# Altium schematic sheet Sheet4.SchDoc: Контроллер нетривиального станка с ЧПУ
size 420 x 297 mm; Author: Барков; CompanyName: BarCockSemenConductor; DrawnBy: Барков; Engineer: Барков; Organization: BarCockSemenConductor; DocumentNumber: хххххххх; SheetNumber: 4; SheetTotal: 5; DocumentName: Sheet1.SCHDOC
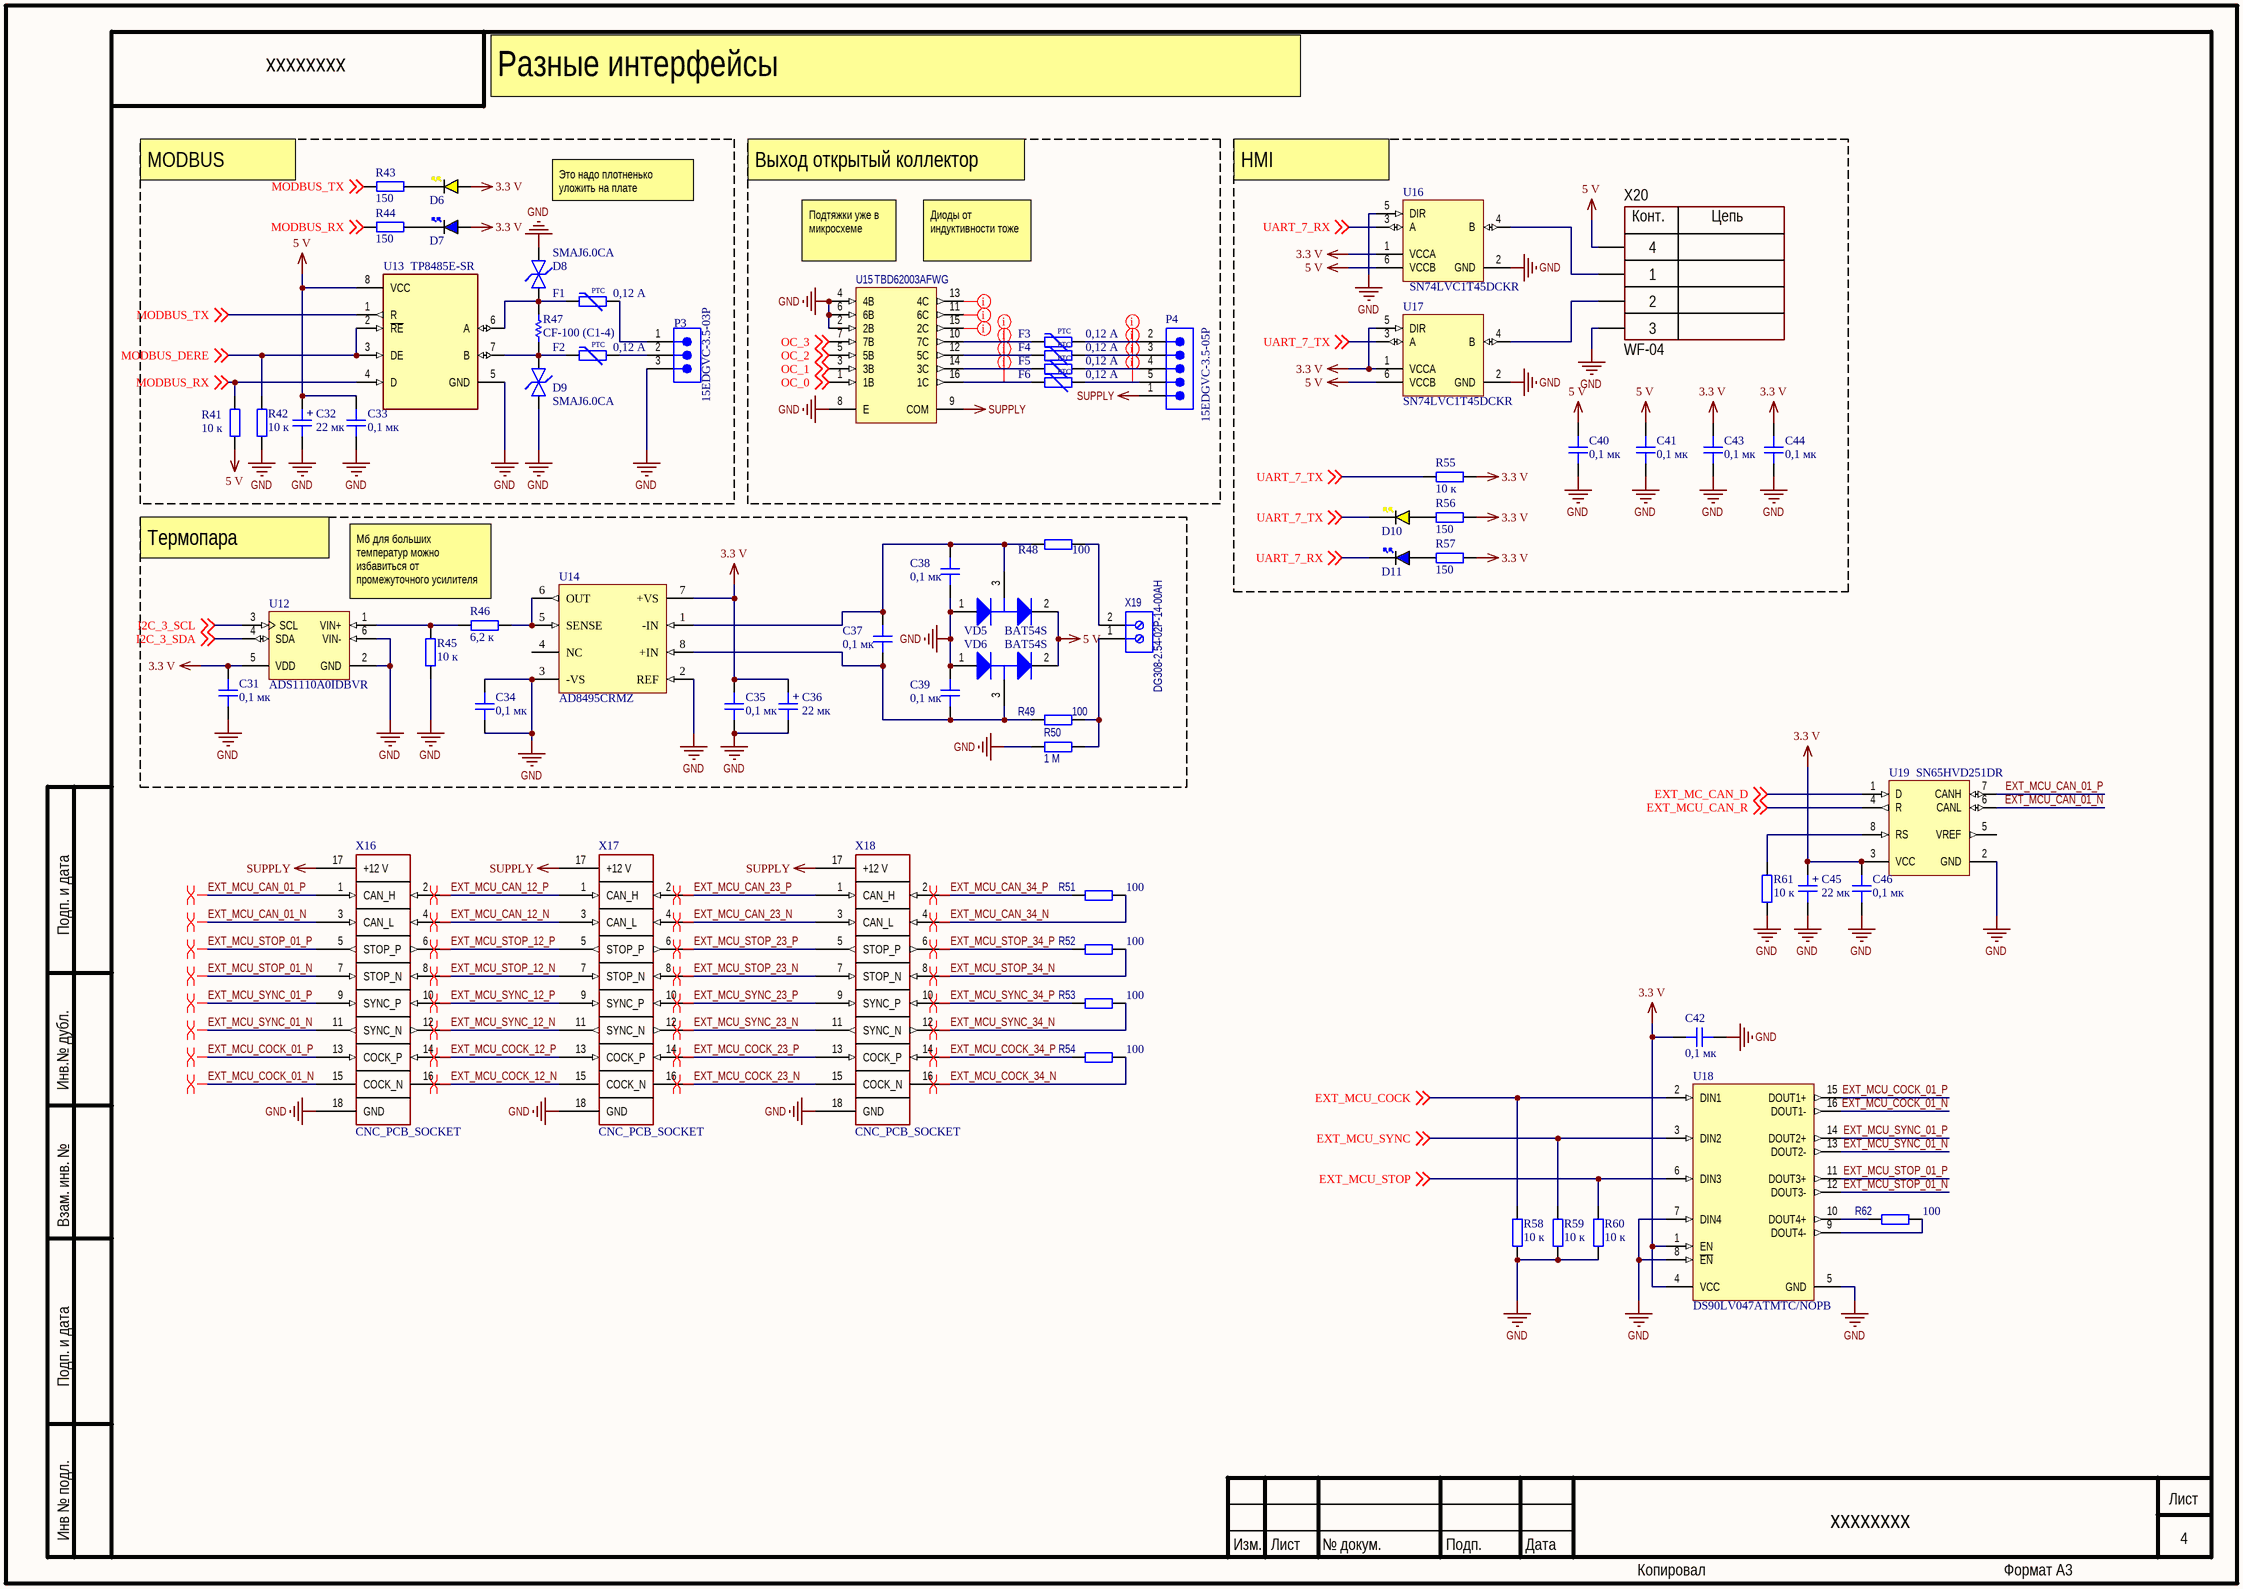
[diagram p0: Sheet4.SchDoc]

## Parts
C31  0,1 мк  [CAP_0603]
C32  22 мк  [TANTAL_B]
C33  0,1 мк  [CAP_0603]
C34  0,1 мк  [CAP_0603]
C35  0,1 мк  [CAP_0603]
C36  22 мк  [TANTAL_B]
C37  0,1 мк  [CAP_0603]
C38  0,1 мк  [CAP_0603]
C39  0,1 мк  [CAP_0603]
C40  0,1 мк  [CAP_0603]
C41  0,1 мк  [CAP_0603]
C42  0,1 мк  [CAP_0603]
C43  0,1 мк  [CAP_0603]
C44  0,1 мк  [CAP_0603]
C45  22 мк  [TANTAL_B]
C46  0,1 мк  [CAP_0603]
D6  YELLOW  [LED_0603_YELLOW]  (value not drawn)
D7  BLUE  [LED_0603_BLUE]  (value not drawn)
D8  SMAJ6.0CA  [SMA]
D9  SMAJ6.0CA  [SMA]
D10  YELLOW  [LED_0603_YELLOW]  (value not drawn)
D11  BLUE  [LED_0603_BLUE]  (value not drawn)
F1  0,12 А  [FUSE_1206]
F2  0,12 А  [FUSE_1206]
F3  0,12 А  [FUSE_1206]
F4  0,12 А  [FUSE_1206]
F5  0,12 А  [FUSE_1206]
F6  0,12 А  [FUSE_1206]
P3  15EDGVC-3.5-03P  [691321100003]
P4  15EDGVC-3.5-05P  [691321100005]
R41  10 к  [RES_0603]
R42  10 к  [RES_0603]
R43  150  [RES_0603]
R44  150  [RES_0603]
R45  10 к  [RES_0603]
R46  6,2 к  [RES_0603]
R47  CF-100 (С1-4)  [OMTE-RES7X2.5-2]
R48  100  [RES_0603]
R49  100  [RES_0603]
R50  1 М  [RES_0603]
R51  100  [RES_0603]
R52  100  [RES_0603]
R53  100  [RES_0603]
R54  100  [RES_0603]
R55  10 к  [RES_0603]
R56  150  [RES_0603]
R57  150  [RES_0603]
R58  10 к  [RES_0603]
R59  10 к  [RES_0603]
R60  10 к  [RES_0603]
R61  10 к  [RES_0603]
R62  100  [RES_0603]
U12  ADS1110A0IDBVR  [TI-DBV6_M]
U13  TP8485E-SR  [FP-D0008A-MFG]
U14  AD8495CRMZ  [FP-RM-8-IPC_A]
U15  TBD62003AFWG  [D0016A_M]
U16  SN74LVC1T45DCKR  [DCK0006A_L]
U17  SN74LVC1T45DCKR  [DCK0006A_L]
U18  DS90LV047ATMTC/NOPB  [MTC16_M]
U19  SN65HVD251DR  [D0008A_N]
VD5  BAT54S  [ONSC-SOT-323-3-419-04_V]
VD6  BAT54S  [ONSC-SOT-323-3-419-04_V]
X16  CNC_PCB_SOCKET  [CNC_PCB_SOCKET]  (no BOM)
X17  CNC_PCB_SOCKET  [CNC_PCB_SOCKET]  (no BOM)
X18  CNC_PCB_SOCKET  [CNC_PCB_SOCKET]  (no BOM)
X19  DG308-2.54-02P-14-00AH  [PHOE-1725656-2]
X20  WF-04  [CON: WF-04]

## Nets
3.3 V: C31.1 C35.1 C36.1 C42.1 C43.1 C44.1 C45.1 C46.1 D6.A D7.A R55.1 R56.2 R57.2 U12.5(VDD) U14.7(+VS) U16.1(VCCA) U17.1(VCCA) U17.5(DIR) U18.1(EN) U18.4(VCC) U19.3(VCC)
5 V: C32.1 C33.1 C40.1 C41.1 R41.2 U13.8(VCC) U16.6(VCCB) U17.6(VCCB) VD5.2(K) VD6.2(K) X20.4
GND: C31.2 C32.2 C33.2 C34.1 C34.2 C35.2 C36.2 C38.2 C39.1 C40.2 C41.2 C42.2 C43.2 C44.2 C45.2 C46.2 D8.K D9.A P3.3 R42.1 R45.1 R50.2 R58.2 R59.2 R60.1 R61.1 U12.2(GND) U12.6(VIN-) U13.5(GND) U14.2(REF) U14.3(-VS) U15.2(2B) U15.4(4B) U15.6(6B) U15.8(E) U16.2(GND) U16.5(DIR) U17.2(GND) U18.5(GND) U18.7(DIN4) U18.8(~{EN}) U19.2(GND) VD5.1(A) VD6.1(A) X16.18(GND) X17.18(GND) X18.18(GND) X20.3
SUPPLY: P4.1 U15.9(COM) X16.17(+12_V) X17.17(+12_V) X18.17(+12_V)
EXT_MC_CAN_D: U19.1(D) ; off-sheet EXT_MC_CAN_D
EXT_MCU_CAN_01_N: U19.6(CANL) X16.3(CAN_L)
EXT_MCU_CAN_01_P: U19.7(CANH) X16.1(CAN_H)
EXT_MCU_CAN_12_N: X16.4(CAN_L) X17.3(CAN_L)
EXT_MCU_CAN_12_P: X16.2(CAN_H) X17.1(CAN_H)
EXT_MCU_CAN_23_N: X17.4(CAN_L) X18.3(CAN_L)
EXT_MCU_CAN_23_P: X17.2(CAN_H) X18.1(CAN_H)
EXT_MCU_CAN_34_N: R51.1 X18.4(CAN_L)
EXT_MCU_CAN_34_P: R51.2 X18.2(CAN_H)
EXT_MCU_CAN_R: U19.4(R) ; off-sheet EXT_MCU_CAN_R
EXT_MCU_COCK: R58.1 U18.2(DIN1) ; off-sheet EXT_MCU_COCK
EXT_MCU_COCK_01_N: U18.16(DOUT1-) X16.15(COCK_N)
EXT_MCU_COCK_01_P: U18.15(DOUT1+) X16.13(COCK_P)
EXT_MCU_COCK_12_N: X16.16(COCK_N) X17.15(COCK_N)
EXT_MCU_COCK_12_P: X16.14(COCK_P) X17.13(COCK_P)
EXT_MCU_COCK_23_N: X17.16(COCK_N) X18.15(COCK_N)
EXT_MCU_COCK_23_P: X17.14(COCK_P) X18.13(COCK_P)
EXT_MCU_COCK_34_N: R54.1 X18.16(COCK_N)
EXT_MCU_COCK_34_P: R54.2 X18.14(COCK_P)
EXT_MCU_STOP: R60.2 U18.6(DIN3) ; off-sheet EXT_MCU_STOP
EXT_MCU_STOP_01_N: U18.12(DOUT3-) X16.7(STOP_N)
EXT_MCU_STOP_01_P: U18.11(DOUT3+) X16.5(STOP_P)
EXT_MCU_STOP_12_N: X16.8(STOP_N) X17.7(STOP_N)
EXT_MCU_STOP_12_P: X16.6(STOP_P) X17.5(STOP_P)
EXT_MCU_STOP_23_N: X17.8(STOP_N) X18.7(STOP_N)
EXT_MCU_STOP_23_P: X17.6(STOP_P) X18.5(STOP_P)
EXT_MCU_STOP_34_N: R52.1 X18.8(STOP_N)
EXT_MCU_STOP_34_P: R52.2 X18.6(STOP_P)
EXT_MCU_SYNC: R59.1 U18.3(DIN2) ; off-sheet EXT_MCU_SYNC
EXT_MCU_SYNC_01_N: U18.13(DOUT2-) X16.11(SYNC_N)
EXT_MCU_SYNC_01_P: U18.14(DOUT2+) X16.9(SYNC_P)
EXT_MCU_SYNC_12_N: X16.12(SYNC_N) X17.11(SYNC_N)
EXT_MCU_SYNC_12_P: X16.10(SYNC_P) X17.9(SYNC_P)
EXT_MCU_SYNC_23_N: X17.12(SYNC_N) X18.11(SYNC_N)
EXT_MCU_SYNC_23_P: X17.10(SYNC_P) X18.9(SYNC_P)
EXT_MCU_SYNC_34_N: R53.1 X18.12(SYNC_N)
EXT_MCU_SYNC_34_P: R53.2 X18.10(SYNC_P)
I2C_3_SCL: U12.3(SCL) ; off-sheet I2C_3_SCL
I2C_3_SDA: U12.4(SDA) ; off-sheet I2C_3_SDA
MODBUS_DERE: R42.2 U13.2(~{RE}) U13.3(DE) ; off-sheet MODBUS_DERE
MODBUS_RX: R41.1 R44.1 U13.4(D) ; off-sheet MODBUS_RX
MODBUS_TX: R43.1 U13.1(R) ; off-sheet MODBUS_TX
OС_0: U15.1(1B) ; off-sheet OС_0
OС_1: U15.3(3B) ; off-sheet OС_1
OС_2: U15.5(5B) ; off-sheet OС_2
OС_3: U15.7(7B) ; off-sheet OС_3
UART_7_RX: D11.K U16.3(A) ; off-sheet UART_7_RX
UART_7_TX: D10.K R55.2 U17.3(A) ; off-sheet UART_7_TX
NetC37_1: C37.1 C38.1 R48.1 U14.1(-IN) VD5.3(K/A)
NetC37_2: C37.2 C39.2 R49.1 U14.8(+IN) VD6.3(K/A)
NetD6_K: D6.K R43.2
NetD7_K: D7.K R44.2
NetD8_A: D8.A F1.2 R47.1 U13.6(A)
NetD9_K: D9.K F2.2 R47.2 U13.7(B)
NetD10_A: D10.A R56.1
NetD11_A: D11.A R57.1
NetF1_1: F1.1 P3.1
NetF2_1: F2.1 P3.2
NetF3_1: F3.1 P4.2
NetF3_2: F3.2 U15.10(7C)
NetF4_1: F4.1 P4.3
NetF4_2: F4.2 U15.12(5C)
NetF5_1: F5.1 P4.4
NetF5_2: F5.2 U15.14(3C)
NetF6_1: F6.1 P4.5
NetF6_2: F6.2 U15.16(1C)
NetR45_2: R45.2 R46.2 U12.1(VIN+)
NetR46_1: R46.1 U14.5(SENSE) U14.6(OUT)
NetR48_2: R48.2 X19.2
NetR49_2: R49.2 R50.1 X19.1
NetR61_2: R61.2 U19.8(RS)
NetR62_1: R62.1 U18.9(DOUT4-)
NetR62_2: R62.2 U18.10(DOUT4+)
NetU16_4: U16.4(B) X20.1
NetU17_4: U17.4(B) X20.2

Not connected (* = marked no-connect by the designer): U14 4(NC); U15 11(6C) 13(4C) 15(2C); U19 5(VREF)

## Layout directives
differential pair: EXT_MCU_CAN_01_N, EXT_MCU_CAN_01_P, EXT_MCU_CAN_12_N, EXT_MCU_CAN_12_P, EXT_MCU_CAN_23_N, EXT_MCU_CAN_23_P, EXT_MCU_CAN_34_N, EXT_MCU_CAN_34_P, EXT_MCU_COCK_01_N, EXT_MCU_COCK_01_P, EXT_MCU_COCK_12_N, EXT_MCU_COCK_12_P, EXT_MCU_COCK_23_N, EXT_MCU_COCK_23_P, EXT_MCU_COCK_34_N, EXT_MCU_COCK_34_P, EXT_MCU_STOP_01_N, EXT_MCU_STOP_01_P, EXT_MCU_STOP_12_N, EXT_MCU_STOP_12_P, EXT_MCU_STOP_23_N, EXT_MCU_STOP_23_P, EXT_MCU_STOP_34_N, EXT_MCU_STOP_34_P, EXT_MCU_SYNC_01_N, EXT_MCU_SYNC_01_P, EXT_MCU_SYNC_12_N, EXT_MCU_SYNC_12_P, EXT_MCU_SYNC_23_N, EXT_MCU_SYNC_23_P, EXT_MCU_SYNC_34_N, EXT_MCU_SYNC_34_P
net class Low_Power_Line: NetF3_1, NetF3_2, NetF4_1, NetF4_2, NetF5_1, NetF5_2, NetF6_1, NetF6_2, NetU15_11, NetU15_13, NetU15_15

## Notes on the sheet
- Разные интерфейсы
- MODBUS
- Выход открытый коллектор
- (near U16) HMI
- Это надо плотненько уложить на плате
- (near U15) Подтяжки уже в микросхеме
- (near U15) Диоды от индуктивности тоже
- Термопара
- Мб для больших температур можно избавиться от промежуточного усилителя
- Подп. и дата
- Инв.№ дубл.
- Взам. инв. №
- Инв № подл.
- Изм.
- Лист
- № докум.
- Подп.
- Дата
- Копировал
- Формат А3
- (in symbol 4-Connector) Конт.; Цепь
- (in symbol CAP_ALEL_16x16.5_25V) +
- (in symbol FUSE_PPTC_1206) PTC

## Library data of the parts
C31 C33-C35 C37-C44 C46 = CAP_0603: Керамический конденсатор; Type: CAP_CERAMIC; Value: 0,1 мк; ChipDip: *; Mount: SMD
C32 C36 C45 = CAP_ALEL_16x16.5_25V: Танталовый конденсатор; Voltage: 6,3; Type: CAP_TANTALUM; ChipDip: 9000629219; Value: 22 мк; Model: *; Mount: SMD
D6 D10 = LED_0603_YELLOW: Жёлтый светодиод; Type: LED; ChipDip: *; Value: YELLOW; Model: *; Mount: SMD
D7 D11 = LED_0805_BLUE: Синий светодиод; Type: LED; ChipDip: *; Value: BLUE; Model: *; Mount: SMD
D8 D9 = D_TVS_BI_SMC: Защитный диод; pin to pad: A>1 K>2; Type: DIODE; Value: 9001169246; Model: SMAJ6.0CA; ChipDip: *; Mount: SMD
F1-F6 = FUSE_PPTC_1206: Самовосстанавливающийся предохранитель; Model: MF-NSMF012-2; ChipDip: 9000072610; Type: FUSE; Value: 0,12 А; Mount: SMD
P3 = CMP-1502-01784-2: Винтовой клеммник; ChipDip: 9000592977; Type: CONNECTOR; Model: 15EDGVC-3.5-03P; Mount: THT
P4 = CMP-1502-01786-2: Винтовой клеммник; ChipDip: 8754518577; Model: 15EDGVC-3.5-05P; Type: CONNECTOR; Mount: THT
R41-R45 R48-R62 = RES_0603: Резистор; Type: RESISTOR; ChipDip: *; Mount: SMD
  R41 R42 R45 R55 R58-R61: Value: 10 к
  R43 R44 R56 R57: Value: 150
  R48 R49 R51-R54 R62: Value: 100
  R50: Value: 1 М
R46 = RES_0603: Резистор; ChipDip: 9000079731; Value: 6,2 к; Type: RESISTOR; Mount: SMD
R47 = CMP-2000-06865-1: Резистор; ChipDip: 1471; Value: 120; Model: CF-100 (С1-4); Type: RESISTOR; Mount: THT
U12 = CMP-0003-00257-2: АЦП с I2C; ChipDip: 2502826194; ComponentLink3URL: http://www.ti.com/litv/pdf/mpds026h; ComponentLink1Description: Manufacturer URL; ComponentLink1URL: http://www.ti.com/; ComponentLink2URL: http://www.ti.com/general/docs/lit/getliterature.tsp?genericPartNumber=ADS1110&fileType=pdf; ComponentLink2Description: Datasheet; ComponentLink3Description: Package Specification; Model: ADS1110A0IDBVR; Type: IC; Mount: SMD
U13 = CMP-04875-000009-1: Конвертер UART <-> RS485; ChipDip: 9001699468; ComponentLink2URL: http://www.ti.com/lit/ds/symlink/sn65hvd11.pdf; ComponentLink2Description: Datasheet; Model: TP8485E-SR; Type: IC; Mount: SMD
U14 = CMP-0887-00061-2: Усилитель термопары; ChipDip: 9000996824; Type: IC; Model: AD8495CRMZ; Mount: SMD
U15 = CMP-2000-04953-1: Сборка транзисторов Дарлингтона; ChipDip: 9000629083; Model: TBD62003AFWG; Type: IC; Mount: SMD
U16 U17 = CMP-0859-00452-3: Конвертер уровней; ChipDip: 9000140400; Type: IC; Model: SN74LVC1T45DCKR; Mount: SMD
U18 = CMP-0058-01148-2: Драйвер LVDS; ChipDip: 9000448213; ComponentLink1Description: DS90LV047A Datasheet; ComponentLink1URL: http://www.national.com/ds/DS/DS90LV047A.pdf; ComponentLink2Description: DS90LV047A Web Page; ComponentLink2URL: http://www.national.com/pf/DS/DS90LV047A.html; ComponentLink3Description: MTC16 Package Page; ComponentLink3URL: http://www.national.com/packaging/folders/mtc16.html; Model: DS90LV047ATMTC/NOPB; Type: IC; Mount: SMD
U19 = CMP-0315-00074-2: Драйвер CAN; ChipDip: 9000342409; ComponentLink1Description: Datasheet; ComponentLink1URL: http://www.ti.com/general/docs/lit/getliterature.tsp?genericPartNumber=SN65HVD251&fileType=pdf; Type: IC; Model: SN65HVD251DR; Mount: SMD
VD5 VD6 = CMP-1055-00559-1: Пара последовательных диодов; ChipDip: 9001106105; Type: DIODE; ComponentLink1URL: http://www.onsemi.com/; ComponentLink1Description: Manufacturer URL; ComponentLink3URL: http://www.onsemi.com/pub_link/Collateral/419-04.PDF; ComponentLink2URL: http://www.onsemi.cn/pub_link/Collateral/BAT54SWT1-D.PDF; ComponentLink3Description: Package Specification; ComponentLink2Description: Datasheet; Model: BAT54S; Mount: SMD
X19 = CMP-2000-05299-1: Рахъёмный винтовой клеммник; ChipDip: 63066; Model: DG308-2.54-02P-14-00AH; Type: CONNECTOR; Mount: THT
X20 = 4-Connector: Штыревой разъём; ChipDip: 8007166683; Model: WF-04; Type: CONNECTOR; Mount: THT